# Altium schematic sheet esquematico.SchDoc
size A4
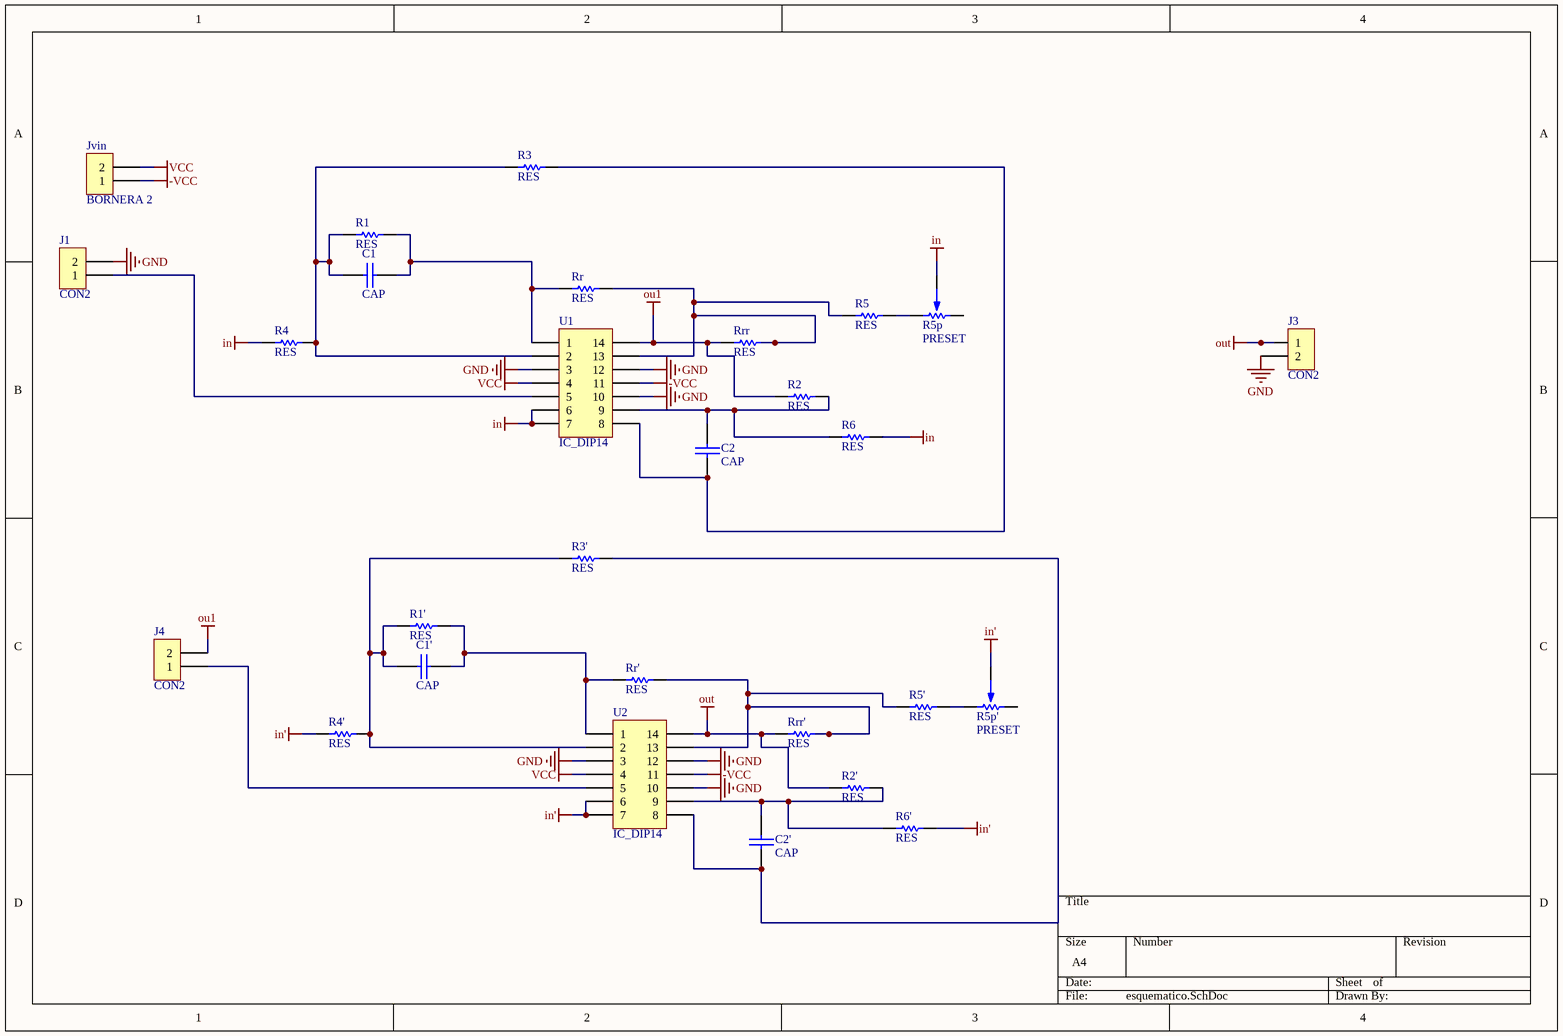
[diagram p0: esquematico.SchDoc]

## Parts
C1  CAP  [CAP200]
C1'  CAP  [CAP200]
C2  CAP  [CAP200]
C2'  CAP  [CAP200]
J1  CON2  [SIP2]
J3  CON2  [SIP2]
J4  CON2  [SIP2]
Jvin  BORNERA 2  [BORNERA2]
R1  RES  [RES400]
R1'  RES  [RES400]
R2  RES  [RES400]
R2'  RES  [RES400]
R3  RES  [RES400]
R3'  RES  [RES400]
R4  RES  [RES400]
R4'  RES  [RES400]
R5  RES  [RES400]
R5'  RES  [RES400]
R5p  PRESET  [PRESET H]
R5p'  PRESET  [PRESET H]
R6  RES  [RES400]
R6'  RES  [RES400]
Rr  RES  [RES400]
Rr'  RES  [RES400]
Rrr  RES  [RES400]
Rrr'  RES  [RES400]
U1  IC_DIP14  [DIP14]
U2  IC_DIP14  [DIP14]

## Nets
-VCC: Jvin.1 U1.11 U2.11
GND: J1.2 J3.2 U1.3 U1.10 U1.12 U2.3 U2.10 U2.12
in: R4.1 R5p.2 R6.2 U1.6 U1.7
in': R4'.1 R5p'.2 R6'.2 U2.6 U2.7
ou1: J4.2 R2.1 Rrr.1 U1.14
out: J3.1 R2'.1 Rrr'.1 U2.14
VCC: Jvin.2 U1.4 U2.4
NetC1'_1: C1'.1 R1'.1 R3'.1 R4'.2 U2.2
NetC1'_2: C1'.2 R1'.2 Rr'.1 U2.1
NetC1_1: C1.1 R1.1 R3.1 R4.2 U1.2
NetC1_2: C1.2 R1.2 Rr.1 U1.1
NetC2'_1: C2'.1 R2'.2 R6'.1 U2.9
NetC2'_2: C2'.2 R3'.2 U2.8
NetC2_1: C2.1 R2.2 R6.1 U1.9
NetC2_2: C2.2 R3.2 U1.8
NetJ1_1: J1.1 U1.5
NetJ4_1: J4.1 U2.5
NetR5'_1: R5'.1 Rr'.2 Rrr'.2 U2.13
NetR5'_2: R5'.2 R5p'.1
NetR5_1: R5.1 Rr.2 Rrr.2 U1.13
NetR5_2: R5.2 R5p.1

Not connected (* = marked no-connect by the designer): R5p 3; R5p' 3